# EAGLE schematic dcs_measurements (EAGLE 9.3.1)
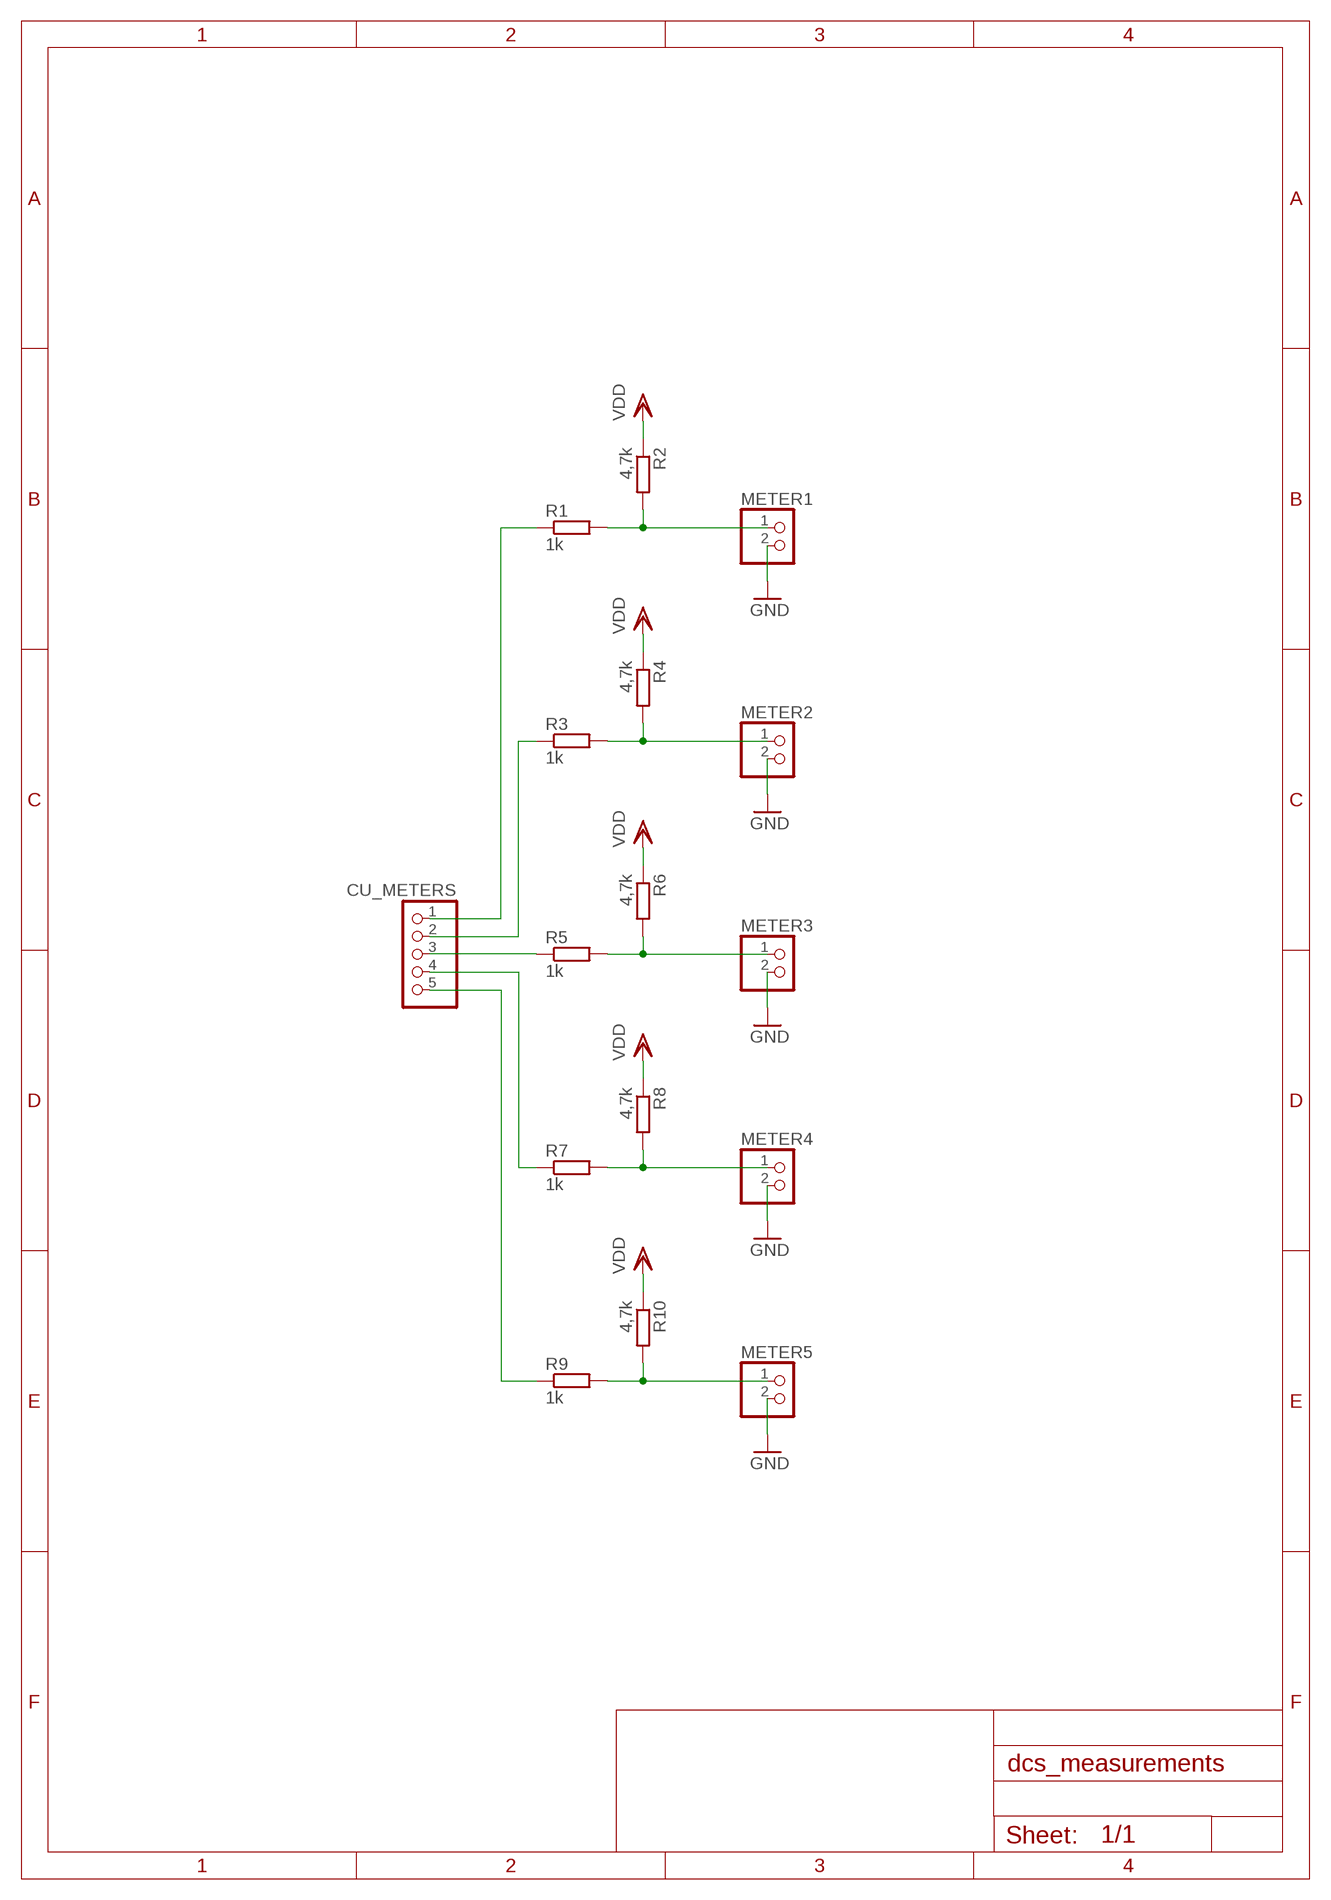
[diagram p0: schematic, sheet 1]

## Parts
CU_METERS  PINHD-1X5  [1X05]
METER1  PINHD-1X2  [1X02]
METER2  PINHD-1X2  [1X02]
METER3  PINHD-1X2  [1X02]
METER4  PINHD-1X2  [1X02]
METER5  PINHD-1X2  [1X02]
R1  1k  R-EU_0207/7  [0207/7]
R2  4,7k  R-EU_0207/7  [0207/7]
R3  1k  R-EU_0207/7  [0207/7]
R4  4,7k  R-EU_0207/7  [0207/7]
R5  1k  R-EU_0207/7  [0207/7]
R6  4,7k  R-EU_0207/7  [0207/7]
R7  1k  R-EU_0207/7  [0207/7]
R8  4,7k  R-EU_0207/7  [0207/7]
R9  1k  R-EU_0207/7  [0207/7]
R10  4,7k  R-EU_0207/7  [0207/7]

## Nets
GND: METER1.2 METER2.2 METER3.2 METER4.2 METER5.2
N$1: METER1.1 R1.2 R2.2
N$2: METER2.1 R3.2 R4.2
N$3: METER3.1 R5.2 R6.2
N$4: METER4.1 R7.2 R8.2
N$5: METER5.1 R9.2 R10.2
N$6: CU_METERS.3 R5.1
N$7: CU_METERS.2 R3.1
N$8: CU_METERS.1 R1.1
N$9: CU_METERS.4 R7.1
N$10: CU_METERS.5 R9.1
VDD: R2.1 R4.1 R6.1 R8.1 R10.1

## Library data of the parts
CU_METERS = pinhead:PINHD-1X5: PIN HEADER
METER1-METER5 = pinhead:PINHD-1X2: PIN HEADER
R1-R10 = rcl:R-EU_: RESISTOR, European symbol; SPICEPREFIX: R